# EAGLE design bigGenericPWM (EAGLE 4.16)
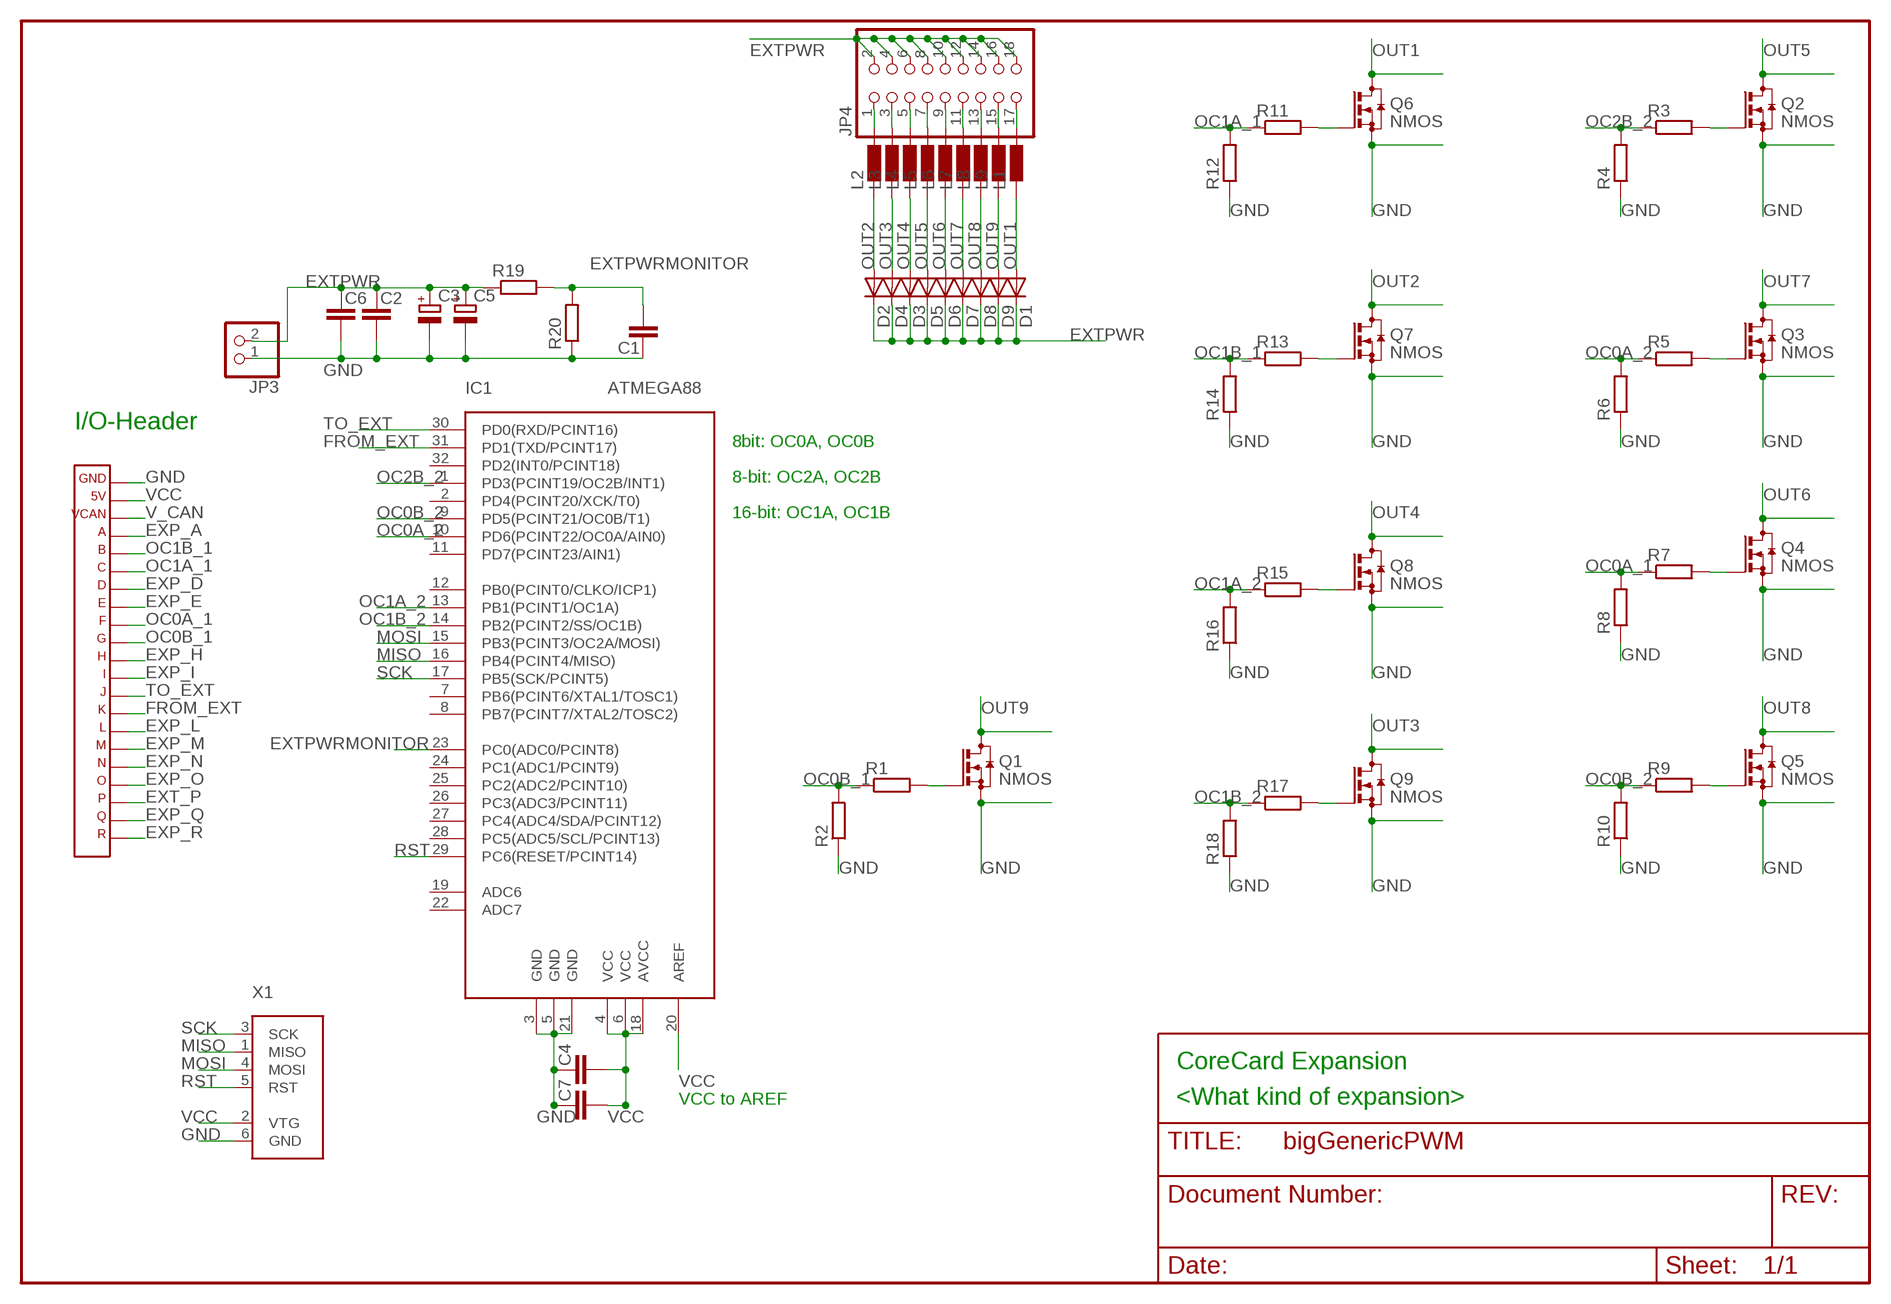
[diagram p0: schematic, sheet 1]

## Parts
C1  C-EUC0603  [C0603]
C2  C-EUC0603  [C0603]
C3  CPOL-EU  [153CLV-0807]
C4  C-EUC0603  [C0603]
C5  CPOL-EU  [153CLV-0807]
C6  C-EUC0603  [C0603]
C7  C-EUC0603  [C0603]
D1  DIODE  [D0603]
D2  DIODE  [D0603]
D3  DIODE  [D0603]
D4  DIODE  [D0603]
D5  DIODE  [D0603]
D6  DIODE  [D0603]
D7  DIODE  [D0603]
D8  DIODE  [D0603]
D9  DIODE  [D0603]
IC1  ATMEGA88  [TQFP32]
JP3  PINHD-1X2  [1X02]
JP4  PINHD-2X9  [2X09]
L1  L-EUL0603  [L0603]
L2  L-EUL0603  [L0603]
L3  L-EUL0603  [L0603]
L4  L-EUL0603  [L0603]
L5  L-EUL0603  [L0603]
L6  L-EUL0603  [L0603]
L7  L-EUL0603  [L0603]
L8  L-EUL0603  [L0603]
L9  L-EUL0603  [L0603]
Q1  NMOS  [SOT23]
Q2  NMOS  [SOT23]
Q3  NMOS  [SOT23]
Q4  NMOS  [SOT23]
Q5  NMOS  [SOT23]
Q6  NMOS  [SOT23]
Q7  NMOS  [SOT23]
Q8  NMOS  [SOT23]
Q9  NMOS  [SOT23]
R1  R-EUR0603  [R0603]
R2  R-EUR0603  [R0603]
R3  R-EUR0603  [R0603]
R4  R-EUR0603  [R0603]
R5  R-EUR0603  [R0603]
R6  R-EUR0603  [R0603]
R7  R-EUR0603  [R0603]
R8  R-EUR0603  [R0603]
R9  R-EUR0603  [R0603]
R10  R-EUR0603  [R0603]
R11  R-EUR0603  [R0603]
R12  R-EUR0603  [R0603]
R13  R-EUR0603  [R0603]
R14  R-EUR0603  [R0603]
R15  R-EUR0603  [R0603]
R16  R-EUR0603  [R0603]
R17  R-EUR0603  [R0603]
R18  R-EUR0603  [R0603]
R19  R-EUR0603  [R0603]
R20  R-EUR0603  [R0603]
X1  AVRISP6PINHEADER  [6PINHEADER]
X3  CORE_IOHEADEXP  [CORE_IOHEAD_NOSILC]

## Nets
EXP_A: X3.4
EXP_D: X3.7
EXP_E: X3.8
EXP_H: X3.11
EXP_I: X3.12
EXP_L: X3.15
EXP_M: X3.16
EXP_N: X3.17
EXP_O: X3.18
EXP_Q: X3.20
EXP_R: X3.21
EXT_P: X3.19
EXTPWR: C2.1 C3.+ C5.+ C6.1 D1.C D2.C D3.C D4.C D5.C D6.C D7.C D8.C D9.C JP3.2 JP4.2 JP4.4 JP4.6 JP4.8 JP4.10 JP4.12 JP4.14 JP4.16 JP4.18 R19.1
EXTPWRMONITOR: C1.2 IC1.23(PC0(ADC0/PCINT8)) R19.2 R20.2
FROM_EXT: IC1.31(PD1(TXD/PCINT17)) X3.14
GND: C1.1 C2.2 C3.- C4.1 C5.- C6.2 C7.1 IC1.3(GND) IC1.5(GND) IC1.21(GND) JP3.1 Q1.2(S) Q2.2(S) Q3.2(S) Q4.2(S) Q5.2(S) Q6.2(S) Q7.2(S) Q8.2(S) Q9.2(S) R2.1 R4.1 R6.1 R8.1 R10.1 R12.1 R14.1 R16.1 R18.1 R20.1 X1.6(GND) X3.1
MISO: IC1.16(PB4(PCINT4/MISO)) X1.1(MISO)
MOSI: IC1.15(PB3(PCINT3/OC2A/MOSI)) X1.4(MOSI)
N$1: Q2.1(G) R3.2
N$2: Q1.1(G) R1.2
N$3: JP4.1 L2.2
N$4: JP4.3 L3.2
N$5: Q3.1(G) R5.2
N$6: Q4.1(G) R7.2
N$7: Q5.1(G) R9.2
N$8: Q6.1(G) R11.2
N$9: Q7.1(G) R13.2
N$10: Q8.1(G) R15.2
N$11: Q9.1(G) R17.2
N$12: JP4.5 L4.2
N$13: JP4.7 L5.2
N$14: JP4.9 L6.2
N$15: JP4.11 L7.2
N$16: JP4.13 L8.2
N$17: JP4.15 L9.2
N$18: JP4.17 L1.2
OC0A_1: R7.1 R8.2 X3.9
OC0A_2: IC1.10(PD6(PCINT22/OC0A/AIN0)) R5.1 R6.2
OC0B_1: R1.1 R2.2 X3.10
OC0B_2: IC1.9(PD5(PCINT21/OC0B/T1)) R9.1 R10.2
OC1A_1: R11.1 R12.2 X3.6
OC1A_2: IC1.13(PB1(PCINT1/OC1A)) R15.1 R16.2
OC1B_1: R13.1 R14.2 X3.5
OC1B_2: IC1.14(PB2(PCINT2/SS/OC1B)) R17.1 R18.2
OC2B_2: IC1.1(PD3(PCINT19/OC2B/INT1)) R3.1 R4.2
OUT1: D1.A L1.1 Q6.3(D)
OUT2: D2.A L2.1 Q7.3(D)
OUT3: D4.A L3.1 Q9.3(D)
OUT4: D3.A L4.1 Q8.3(D)
OUT5: D5.A L5.1 Q2.3(D)
OUT6: D6.A L6.1 Q4.3(D)
OUT7: D7.A L7.1 Q3.3(D)
OUT8: D8.A L8.1 Q5.3(D)
OUT9: D9.A L9.1 Q1.3(D)
RST: IC1.29(PC6(RESET/PCINT14)) X1.5(RST)
SCK: IC1.17(PB5(SCK/PCINT5)) X1.3(SCK)
TO_EXT: IC1.30(PD0(RXD/PCINT16)) X3.13
V_CAN: X3.3
VCC: C4.2 C7.2 IC1.4(VCC) IC1.6(VCC) IC1.18(AVCC) IC1.20(AREF) X1.2(VTG) X3.2
Unconnected: IC1.2(PD4(PCINT20/XCK/T0)) IC1.7(PB6(PCINT6/XTAL1/TOSC1)) IC1.8(PB7(PCINT7/XTAL2/TOSC2)) IC1.11(PD7(PCINT23/AIN1)) IC1.12(PB0(PCINT0/CLKO/ICP1)) IC1.19(ADC6) IC1.22(ADC7) IC1.24(PC1(ADC1/PCINT9)) IC1.25(PC2(ADC2/PCINT10)) IC1.26(PC3(ADC3/PCINT11)) IC1.27(PC4(ADC4/SDA/PCINT12)) IC1.28(PC5(ADC5/SCL/PCINT13)) IC1.32(PD2(INT0/PCINT18))

## Notes on the sheet
- I/O-Header
- 8bit: OC0A, OC0B
- 8-bit: OC2A, OC2B
- 16-bit: OC1A, OC1B
- CoreCard Expansion
- VCC to AREF | <What kind of expansion>

## Library data of the parts
C1 C2 C4 C6 C7 = rcl:C-EU
C3 C5 = rcl:CPOL-EU
D1-D9 = diode:DIODE: DIODE ultra fast rectifier, 3 A
IC1 = atmega88:ATMEGA88
JP3 = pinhead:PINHD-1X2: PIN HEADER
JP4 = pinhead:PINHD-2X9: PIN HEADER
L1-L9 = rcl:L-EU
Q1-Q9 = transistor:NMOS
R1-R20 = rcl:R-EU
X1 = avrisp:AVRISP6PIN
X3 = expboard:CORE_IOHEAD: CoreCard IO-header for expansion cards

## Board
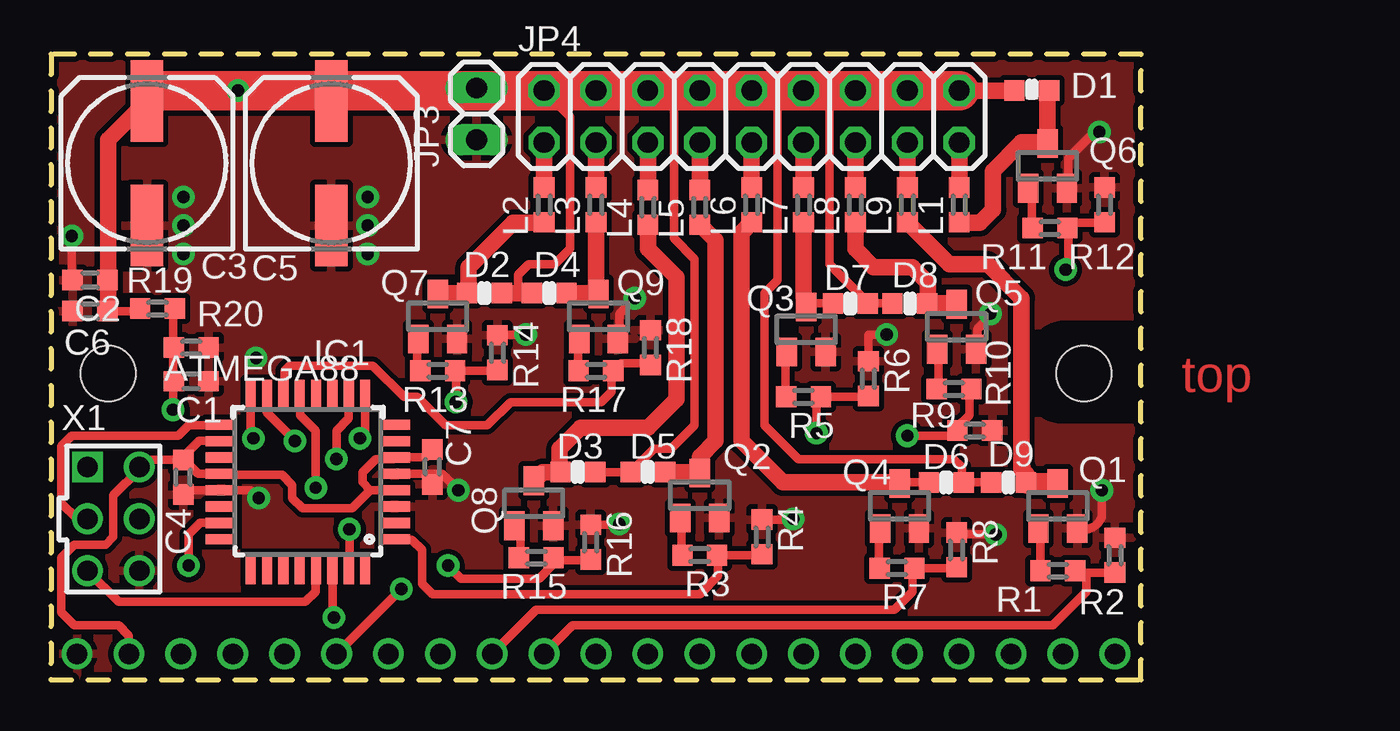
[diagram p1: board, top side]
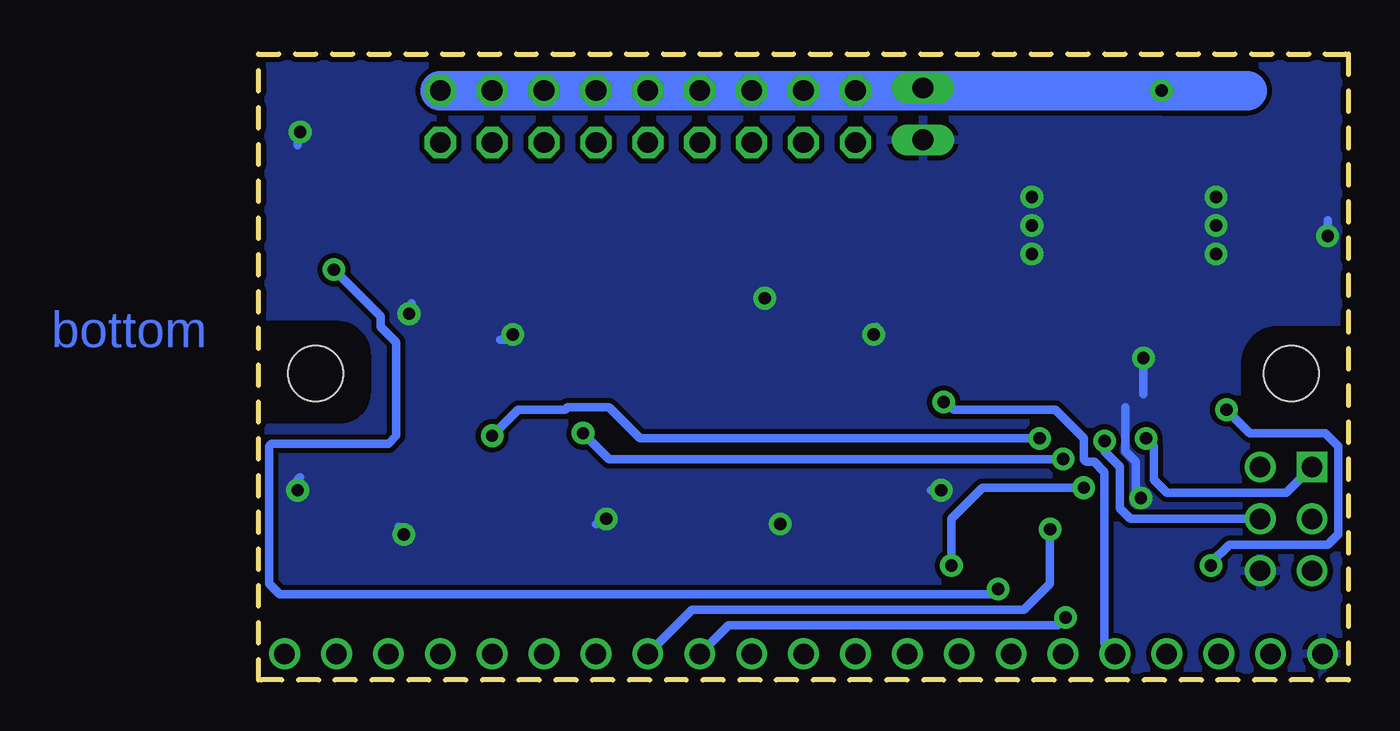
[diagram p2: board, bottom side, seen from below]

Size 53.34 x 30.61 mm. Coordinates in mm from the lower left corner, seen from the top.
Outline: 0,0 53.34,0 53.34,30.61 0,30.61 0,0
Copper layers (1*16): Top 0.035mm / dielectric 1.5mm / Bottom 0.035mm
Design rules "default": minimum track width 10mil, minimum drill 0.6mm, track to track 10mil, track to pad 10mil, pad to pad 10mil, via to via 10mil, smd to smd 8mil, copper to edge 10mil, drill to drill 8mil, minimum pad ring 10mil, minimum via ring 10mil, stop-mask expansion 4mil, vias tented up to drill 0mil, thermal gap 10mil
Holes 2.7 mm at 50.55,14.99 2.79,14.99

### Footprints (pad centres in the part's own frame; a part is rotated, then mirrored left to right if it is on the bottom)
C0603 = smd 1 x 1: 1 -0.85,0; 2 0.85,0
153CLV-0807 = smd 4 x 1.6: + 3.05,0; - -3.05,0
D0603 = smd 0.991 x 1.016: A 0.85,0; C -0.85,0
TQFP32 = smd 1.5 x 0.5: 1 -4.25,2.65; 2 -4.25,1.85; 3 -4.25,1.05; 4 -4.25,0.25; 5 -4.25,-0.55; 6 -4.25,-1.35; 7 -4.25,-2.15; 8 -4.25,-2.95; 17 4.25,-2.95; 18 4.25,-2.15; 19 4.25,-1.35; 20 4.25,-0.55; 21 4.25,0.25; 22 4.25,1.05; 23 4.25,1.85; 24 4.25,2.65 | smd 0.5 x 1.5: 9 -2.8,-4.4; 10 -2,-4.4; 11 -1.2,-4.4; 12 -0.4,-4.4; 13 0.4,-4.4; 14 1.2,-4.4; 15 2,-4.4; 16 2.8,-4.4; 25 2.8,4.1; 26 2,4.1; 27 1.2,4.1; 28 0.4,4.1; 29 -0.4,4.1; 30 -1.2,4.1; 31 -2,4.1; 32 -2.8,4.1
1X02 = drill 1.016 long: 1 -1.27,0; 2 1.27,0
2X09 = drill 1.016 octagon: 1 -10.16,-1.27; 2 -10.16,1.27; 3 -7.62,-1.27; 4 -7.62,1.27; 5 -5.08,-1.27; 6 -5.08,1.27; 7 -2.54,-1.27; 8 -2.54,1.27; 9 0,-1.27; 10 0,1.27; 11 2.54,-1.27; 12 2.54,1.27; 13 5.08,-1.27; 14 5.08,1.27; 15 7.62,-1.27; 16 7.62,1.27; 17 10.16,-1.27; 18 10.16,1.27
L0603 = smd 0.991 x 1.016: 1 -0.85,0; 2 0.85,0
SOT23@1 = smd 1 x 1.4: 1 -0.95,-1.1; 2 0.95,-1.1; 3 0,1.1
R0603 = smd 0.991 x 1.016: 1 -0.85,0; 2 0.85,0
6PINHEADER = drill 1 square: 1 -1.27,2.54 | drill 1 round: 2 1.27,2.54; 3 -1.27,0; 4 1.27,0; 5 -1.27,-2.54; 6 1.27,-2.54
CORE_IOHEAD_NOSILC = drill 1 round: 1 25.4,0; 2 22.86,0; 3 20.32,0; 4 17.78,0; 5 15.24,0; 6 12.7,0; 7 10.16,0; 8 7.62,0; 9 5.08,0; 10 2.54,0; 11 0,0; 12 -2.54,0; 13 -5.08,0; 14 -7.62,0; 15 -10.16,0; 16 -12.7,0; 17 -15.24,0; 18 -17.78,0; 19 -20.32,0; 20 -22.86,0; 21 -25.4,0

### Placement (x,y rotation side)
C1  6.86,14.61 180 top
C2  1.91,19.56 180 top
C3  4.7,25.27 90 top
C4  6.48,9.91 90 top
C5  13.72,25.27 90 top
C6  1.91,18.03 180 top
C7  18.67,10.41 90 top
D1  48.01,28.83 0 top
D2  21.21,18.92 180 top
D3  25.78,10.16 180 top
D4  24.38,18.92 0 top
D5  29.21,10.16 0 top
D6  43.81,9.65 180 top
D7  39.12,18.41 180 top
D8  42.04,18.41 0 top
D9  46.86,9.65 0 top
IC1  12.57,9.53 180 top
JP3  20.83,27.69 90 top
JP4  34.29,27.56 0 top
L1  44.45,23.24 90 top
L2  24.13,23.24 90 top
L3  26.67,23.24 90 top
L4  29.21,23.11 90 top
L5  31.75,23.11 90 top
L6  34.29,23.24 90 top
L7  36.83,23.24 90 top
L8  39.37,23.24 90 top
L9  41.91,23.24 90 top
Q1  NMOS  [SOT23@1]  49.28,8.51 0 top
Q2  NMOS  [SOT23@1]  31.75,9.02 0 top
Q3  NMOS  [SOT23@1]  36.96,17.14 0 top
Q4  NMOS  [SOT23@1]  41.53,8.51 0 top
Q5  NMOS  [SOT23@1]  44.32,17.27 0 top
Q6  NMOS  [SOT23@1]  48.77,25.15 0 top
Q7  NMOS  [SOT23@1]  18.92,17.78 0 top
Q8  NMOS  [SOT23@1]  23.62,8.64 0 top
Q9  NMOS  [SOT23@1]  26.8,17.78 0 top
R1  49.28,5.33 180 top
R2  52.07,6.1 270 top
R3  31.75,6.1 180 top
R4  34.8,6.99 270 top
R5  36.83,13.84 180 top
R6  40.01,14.73 270 top
R7  41.4,5.46 180 top
R8  44.32,6.35 270 top
R9  44.2,14.22 180 top
R10  45.21,12.19 180 top
R11  48.9,22.1 180 top
R12  51.56,23.24 270 top
R13  18.92,15.11 180 top
R14  21.84,16 270 top
R15  23.75,5.97 180 top
R16  26.42,6.73 270 top
R17  26.67,15.11 180 top
R18  29.34,16.26 270 top
R19  5.21,18.16 0 top
R20  6.86,16.26 180 top
X1  3.05,7.87 0 top
X3  26.67,1.27 0 bottom

### Tracks (layer width: path | path; a pad name or v marks a point on that pad's centre or on a via)
EXTPWR  (via drill 0.6)
  Top 0.406: R19.1 4.23,18.03 C6.1 | JP4.2 25.4,27.56 25.4,21.08 24.64,20.32 23.37,20.32 22.86,19.81 22.86,18.92 | D4.C 23.5,18.96 23.5,19.18 | 40.01,18.41 D8.C | 40.01,18.41 D7.C | 40.01,18.41 38.1,20.32 38.1,28.83 | D6.C 44.79,9.53 | D6.C 44.58,9.74 44.58,10.41 44.2,10.79 36.58,10.79 34.92,12.45 34.92,18.92 35.56,19.56 35.56,28.83 | 26.54,10.16 D3.C D5.C 29.5,11.3 30.35,11.3 31.5,12.45 31.5,20.57 30.48,21.59 30.48,28.83 | D6.C D9.C
  Top 0.813: D2.C 22.86,18.92 D4.C | JP4.18 D1.C | JP4.4 26.54,28.83 | 20.83,28.83 JP3.2 20.7,28.83 | C5.+ | 13.84,28.83 13.72,28.7 C5.+ | 4.95,28.7 4.95,28.58 C3.+ 2.79,26.42 2.79,19.6 C2.1 2.79,19.52 2.79,18.07 C6.1 | C5.+ 13.34,28.7
  Top 1.93: JP4.18 JP4.16 JP4.14 38.1,28.83 JP4.12 35.56,28.83 JP4.10 JP4.8 30.48,28.83 JP4.6 JP4.4 JP4.2 20.83,28.83 | 20.7,28.83 13.84,28.83 v9.14,28.83 4.95,28.83 4.95,28.7
  Bottom 1.93: JP4.18 v9.14,28.83 4.95,28.83
EXTPWRMONITOR  (via drill 0.6)
  Top 0.406: 5.97,16.26 R20.2 | R19.2 5.97,18.07 5.97,16.26 | 5.97,14.61 5.97,14.48 6.01,14.52 C1.2 5.97,14.61 | 5.97,14.61 5.97,16.26 | IC1.23 7.29,7.67 6.73,7.11 v6.73,5.59 | v5.97,13.21 5.97,14.61
  Bottom 0.406: v6.73,5.59 6.73,5.71 5.84,6.6 1.02,6.6 0.51,7.11 0.51,11.43 1.14,12.06 4.83,12.06 v5.97,13.21
FROM_EXT  (via drill 0.6)
  Top 0.406: 14.61,5.39 14.61,5.33 | 14.61,5.39 IC1.31 | v14.61,7.37 14.61,5.39
  Bottom 0.406: X3.14 32.13,3.43 15.88,3.43 14.61,4.7 v14.61,7.37
GND  (via drill 0.6)
  Top 0.406: C2.2 1.02,19.6 v1.02,21.72 | R14.1 21.88,16.89 v23.24,16.89 | Q9.2 27.81,16.75 27.81,17.91 v28.57,18.67 | R6.1 40.01,16.89 v40.89,16.89 | Q5.2 45.34,16.24 45.34,17.14 45.97,17.78 v45.97,17.91 | Q6.2 49.78,24.11 49.78,25.53 51.05,26.8 v51.31,26.8 | R8.1 44.41,7.11 v46.23,7.11 | Q1.2 arc90 51.44,7.98 v51.44,9.27 | R4.1 35.9,7.83 | R16.1 27.77,7.58 v27.81,7.62 | 6.6,9.14 6.57,9.18 | 6.6,9.14 6.74,9.28 IC1.21 9.78,9.27 v10.16,8.89 | IC1.5 19.14,10.07 v19.94,9.27 | v10.03,15.75 9.91,15.88 9.91,16 | C4.1 6.57,9.14 6.6,9.14
  Bottom 0.406: v1.02,21.72 1.02,22.48 | v23.24,16.89 23.11,17.02 23.11,17.27 | v28.57,18.67 28.57,18.92 | v40.89,16.89 41.15,16.64 41.53,16.64 | v45.97,17.91 45.85,18.03 45.85,18.41 | v51.31,26.8 51.44,26.67 51.44,26.16 | v46.23,7.11 46.48,7.37 46.48,7.49 | v51.44,9.27 51.44,9.78 51.31,9.91 | v36.32,7.87 36.58,7.87 36.83,7.62 | v27.81,7.62 28.07,7.62 | v19.94,9.27 20.45,9.27 | v10.16,8.89 10.41,9.14 10.41,10.67 10.92,11.18 10.92,13.34 | 10.03,13.97 v10.03,15.75
  other vias: 6.48,23.62 6.48,22.23 6.48,20.83 15.49,23.62 15.49,22.23 15.49,20.83
  pour Top: 0,30.61 53.34,30.61 53.34,17.78 49.66,17.78 arc90 47.62,15.88 47.62,14.1 arc90 49.53,12.32 53.34,12.32 53.34,0 0,0 0,12.06 3.68,12.06 arc90 5.46,13.97 5.46,15.49 arc90 3.56,17.53 0,17.53
  pour Bottom: 0,30.61 53.34,30.61 53.34,17.78 49.53,17.78 arc90 47.62,15.88 47.62,14.1 arc90 49.4,12.32 53.34,12.32 53.34,0 0,0 0,12.06 3.56,12.06 arc90 5.46,13.97 5.46,15.49 arc90 3.43,17.53 0,17.53
MISO  (via drill 0.6)
  Top 0.406: IC1.16 9.78,11.94 v9.91,11.81
  Bottom 0.406: X1.1 3.05,9.14 8.89,9.14 9.53,9.78 9.53,11.43 v9.91,11.81
MOSI  (via drill 0.6)
  Top 0.406: 10.54,13.97 10.54,13.96 IC1.15 10.54,13.89 10.54,13.08 v11.94,11.68
  Bottom 0.406: X1.4 10.67,7.87 11.18,8.38 11.18,10.41 11.94,11.18 v11.94,11.68
N$1
  Top 0.406: R3.2 30.86,6.13 30.86,7.86 Q2.1
N$2
  Top 0.406: Q1.1 48.34,7.41 48.43,7.33 R1.2
N$3
  Top 0.813: L2.2 JP4.1
N$4
  Top 0.813: L3.2 JP4.3
N$5
  Top 0.406: Q3.1 35.96,16 35.94,16 35.94,13.88 R5.2
N$6
  Top 0.406: R7.2 40.51,5.46 40.51,7.34 Q4.1
N$7
  Top 0.406: Q5.1 43.42,16.13 43.43,16.13 43.43,14.31 R9.2
N$8
  Top 0.406: R11.2 48.01,22.1 48.01,23.86 Q6.1
N$9
  Top 0.406: Q7.1 17.91,16.61 17.91,15.28 R13.2
N$10
  Top 0.406: Q8.1 22.99,7.22 22.99,5.97 | 22.99,5.97 22.99,5.93 | 22.99,5.97 R15.2
N$11
  Top 0.406: Q9.1 25.8,16.64 25.78,16.64 25.78,15.15 R17.2
N$12
  Top 0.813: L4.2 JP4.5
N$13
  Top 0.813: 31.75,23.88 L5.2 JP4.7
N$14
  Top 0.813: L6.2 JP4.9
N$15
  Top 0.813: 36.83,24.13 L7.2 JP4.11
N$16
  Top 0.813: L8.2 JP4.13
N$17
  Top 0.813: L9.2 JP4.15
N$18
  Top 0.813: L1.2 JP4.17
OC0A_1
  Top 0.406: X3.9 23.75,3.43 41.27,3.43 42.16,4.32 42.16,5.46 R7.1 44.36,5.46 | 44.36,5.46 44.45,5.46 | 44.36,5.46 R8.2
OC0A_2  (via drill 0.6)
  Top 0.406: v13.97,10.79 13.97,12.19 14.57,12.79 IC1.10 | 37.72,13.84 R5.1 | v37.47,12.06 37.47,13.59 37.72,13.84 | R6.2 40.01,13.84 37.72,13.84
  Bottom 0.406: v13.97,10.79 36.2,10.79 v37.47,12.06
OC0B_1
  Top 0.406: X3.10 25.53,2.67 49.02,2.67 50.67,4.32 50.67,5.25 | R2.2 52.07,5.21 52.03,5.25 50.67,5.25 | 50.67,5.25 50.38,5.25 50.29,5.33 R1.1
OC0B_2  (via drill 0.6)
  Top 0.406: IC1.9 15.37,12.07 v15.11,11.81 | R9.1 45.05,14.14 45.09,14.1 44.96,13.97 44.96,12.95 44.32,12.32 44.36,12.28 R10.2 44.32,12.19 44.32,11.94 v41.91,11.94
  Bottom 0.406: v15.11,11.81 34.67,11.81 36.2,13.34 38.23,13.34 38.35,13.21 40.64,13.21 v41.91,11.94
OC1A_1  (via drill 0.6)
  Top 0.406: R12.2 51.52,22.35 50,22.35 R11.1 49.78,22.14 | X3.6 v17.14,4.45 | 49.78,22.14 49.78,22.23 | v49.66,20.07 49.78,20.19 49.78,22.14
  Bottom 0.406: v17.14,4.45 17.14,4.19 52.32,4.19 52.83,4.7 52.83,11.43 52.7,11.56 46.99,11.56 46.61,11.94 46.61,16.51 47.37,17.27 47.37,17.78 v49.66,20.07
OC1A_2  (via drill 0.6)
  Top 0.406: R16.2 26.38,5.84 24.64,5.84 | IC1.13 12.19,13.91 12.19,12.95 12.95,12.19 v12.95,9.4 | v19.43,5.59 20.07,4.95 23.88,4.95 24.64,5.71 24.64,5.84 | R15.1 24.64,5.93 24.64,5.84
  Bottom 0.406: v12.95,9.4 17.91,9.4 19.43,7.87 v19.43,5.59
OC1B_1  (via drill 0.6)
  Top 0.406: R14.2 21.8,15.11 R13.1 19.68,15.11 19.81,14.99 v19.81,13.59
  Bottom 0.406: X3.5 11.94,1.78 11.94,10.16 12.45,10.67 12.83,10.67 12.95,10.79 12.95,11.81 14.35,13.21 19.3,13.21 19.68,13.59 v19.81,13.59
OC1B_2
  Top 0.406: IC1.14 11.42,13.97 11.43,13.97 11.43,15.11 11.68,15.37 15.75,15.37 17.27,13.84 17.91,13.84 19.3,12.45 21.34,12.45 22.48,13.59 26.92,13.59 27.43,14.1 27.43,15.11 R17.1 27.9,15.49 29.25,15.49 R18.2
OC2B_2
  Top 0.406: R4.2 34.76,6.1 32.64,6.1 | IC1.1 16.84,6.86 17.65,6.86 18.16,6.35 18.16,4.7 18.67,4.19 31.75,4.19 32.64,5.08 32.64,6.1 | 32.64,6.1 R3.1
OUT1
  Top 0.813: L1.1 44.45,22.35 45.47,22.35 46.1,22.99 46.1,24.89 47.5,26.29 48.73,26.29 Q6.3 48.77,28.74 D1.A
OUT2
  Top 0.61: D2.A 20.45,18.92 20.45,18.88
  Top 0.813: 20.45,18.92 20.45,20.19 22.61,22.35 24.13,22.35 L2.1 | Q7.3 18.97,18.92 D2.A
OUT3
  Top 0.813: 26.8,18.92 Q9.3 | D4.A 26.8,18.92 | 26.8,18.92 26.67,19.05 L3.1
OUT4
  Top 0.813: Q8.3 24.05,10.16 D3.A 24.89,10.2 24.89,11.3 25.91,12.32 29.21,12.32 30.61,13.72 30.61,19.68 29.21,21.08 L4.1
OUT5
  Top 0.813: D5.A 31.75,10.16 Q2.3 31.75,10.92 32.51,11.68 32.51,21.5 L5.1
OUT6
  Top 0.406: 41.53,9.65 D6.A
  Top 0.813: L6.1 33.78,21.88 33.78,11.68 35.81,9.65 41.53,9.65 Q4.3
OUT7
  Top 0.406: Q3.3 36.96,18.41 38.23,18.41 | 38.23,18.41 D7.A | 38.1,18.38 38.14,18.41 38.23,18.41
  Top 0.61: 38.1,18.38 38.1,18.29 | Q3.3 37,18.29
  Top 0.813: 37,18.29 37.13,18.41 36.83,18.71 L7.1
OUT8
  Top 0.813: L8.1 39.37,21.08 40.26,20.19 42.16,20.19 42.93,19.43 42.93,18.41 D8.A 44.28,18.41 Q5.3
OUT9
  Top 0.406: 47.5,10.45 47.5,10.41 47.56,10.35 47.71,10.2 | 47.75,9.65 47.88,9.65 47.92,9.61
  Top 0.813: 47.5,10.45 47.5,18.67 45.85,20.32 43.98,20.32 L9.1 | 47.56,10.35 47.5,10.29 47.75,10.03 47.75,9.65
  Top 1.016: D9.A 47.75,9.65 47.8,9.61 Q1.3
RST
  Top 0.406: X1.5 3.3,3.81 12.45,3.81 12.95,4.32 12.95,5.41 IC1.29
SCK
  Top 0.406: IC1.17 8.29,12.45 6.73,12.45 6.22,11.94 1.02,11.94 0.51,11.43 0.51,8.64 1.27,7.87 X1.3
TO_EXT  (via drill 0.6)
  Top 0.406: IC1.30 13.77,3.12 v13.84,3.05
  Bottom 0.406: X3.13 30.35,2.67 14.22,2.67 v13.84,3.05
VCC
  Top 0.406: 4.32,10.29 4.19,10.29 | IC1.20 8.28,10.03 | X1.2 4.57,10.41 | IC1.18 7.24,11.68 6.48,10.92 C4.2 | 15.62,9.28 IC1.4 | 15.62,9.28 15.24,9.65 15.24,10.16 15.88,10.79 16.76,10.79 16.76,10.82 IC1.6 18.37,10.88 18.67,11.18 C7.2 | IC1.20 8.37,10.03 11.3,10.03 11.81,9.53 11.81,8.89 12.32,8.38 14.73,8.38 15.62,9.27 15.62,9.28 | C4.2 4.66,10.76 X1.2 | C4.2 6.48,10.79 7.2,10.07 IC1.20 | X3.2 3.81,2.16 3.3,2.67 1.14,2.67 0.51,3.3 0.51,5.97 1.14,6.6 2.67,6.6 3.05,6.99 3.05,9.02 4.32,10.29 | 4.32,10.29 X1.2

### Text on the board
Top: top
Bottom: bottom
tStop: top
bStop: bottom
Document: Top is component side | Expansion will be mounted bottom to bottom with CoreCard | Change vertical dimension to fit | Remove I/O-header silcscreen if neccesary | Remove mounting holes if neccesary